# EAGLE design Jeju_v1 v1 (EAGLE 9.7.0)
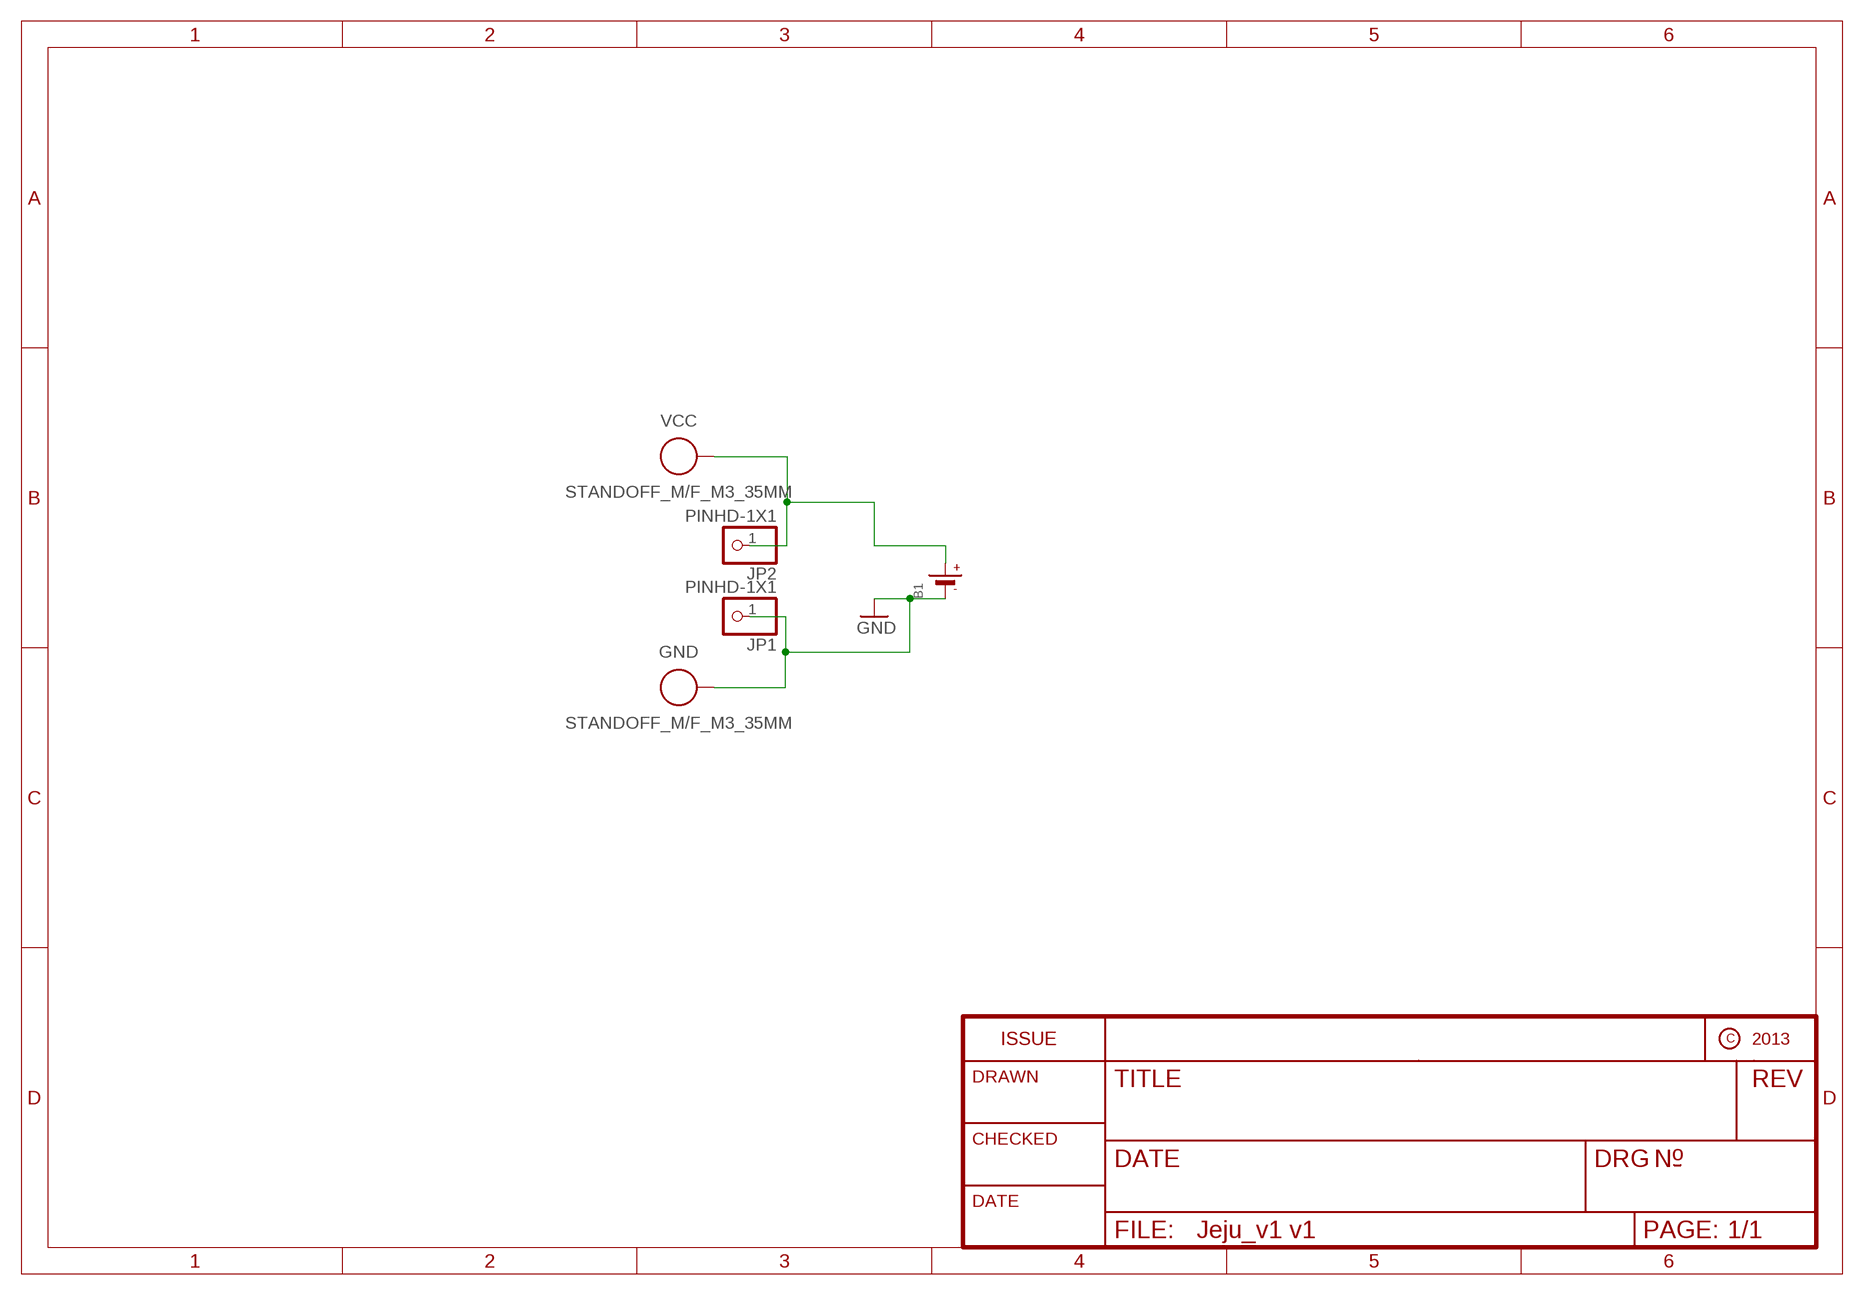
[diagram p0: schematic, sheet 1]

## Parts
B1  BATTERYCR2032_BAT-HLD-001  [CR2032_SMT_BAT-HLD-001]
GND  STANDOFF_M/F_M3_35MM  [STANDOFF_HEX_MALE-FEMALE_500X3500_M3X0.5_MTGP800H320]
JP1  PINHD-1X1  [1X01]
JP2  PINHD-1X1  [1X01]
VCC  STANDOFF_M/F_M3_35MM  [STANDOFF_HEX_MALE-FEMALE_500X3500_M3X0.5_MTGP800H320]

## Nets
3V: B1.+$1(+) B1.+$2(+) JP2.1 VCC.1
GND: B1.- GND.1 JP1.1

## Library data of the parts
B1 = microbuilder:BATTERY: CR1220 SMT - Digikey: 3001K-ND CD2032 BAT-HLD-001 - Digikey: BAT-HLD-001-ND
GND VCC = PCB-Fasteners_Hardware:STANDOFF_M/F: Male-Male Standoff/Spacer with Mounting pad and hole. Essentra : Male-Female Standoff <https://www.essentracomponents.co.in/index.php?option=com_virtuemart&view=productdetails&virtuemart_product_id=14556> The hole and pad sizes may vary based on the application and type of hardware; always verify the Manufacturer specification or Global Standards.; CATEGORY: Standoff/Spacer; SUB-CATEGORY: Male-Female
JP1 JP2 = Connector:PINHD-1X1: PIN HEADER; CATEGORY: Headers; DESCRIPTION: Header, Straight, 1 Position; MANUFACTURER: Generic; MPN: Generic; OPERATING_TEMPERATURE: Generic; PART_STATUS: Active; PITCH: 0.100" (2.54mm); ROHS_COMPLIANCE: Generic; SERIES: Generic; SUB-CATEGORY: Headers, Male Pins; TYPE: Board to Board or Cable, Unshrouded, Through Hole, Straight

## Board
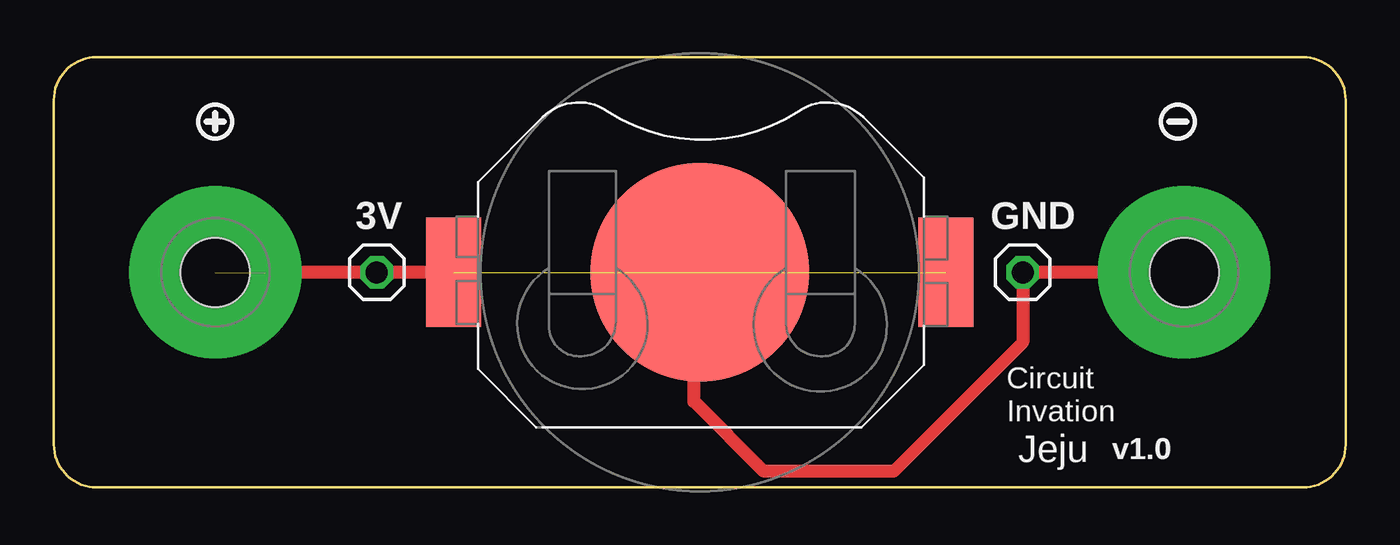
[diagram p1: board, top side]
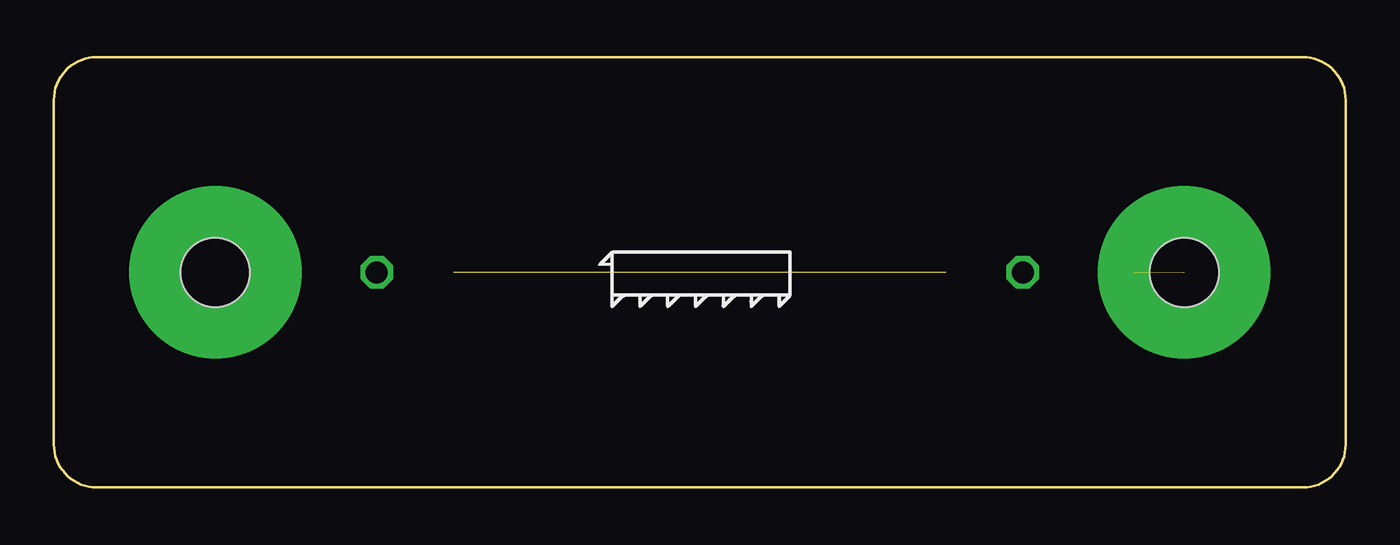
[diagram p2: board, bottom side, seen from below]

Size 60 x 20 mm. Coordinates in mm from the lower left corner, seen from the top.
Outline: 60,18 60,2 arc-90 58,0 2,0 arc-90 0,2 0,18 arc-90 2,20 58,20 arc-90 60,18
Copper layers (1*16): Top / Bottom
Stack-up Default Layer Stack: Top User Defined 0.035mm / Dielectric-1 User Defined 1.5mm / Bottom User Defined 0.035mm
Design rules "default": minimum track width 10mil, minimum drill 16mil, track to track 8mil, track to pad 8mil, pad to pad 8mil, via to via 8mil, smd to smd 8mil, copper to edge 10mil, drill to drill 8mil, minimum pad ring 10mil, minimum via ring 8mil, stop-mask expansion 4mil, vias tented up to drill 20mil, thermal gap 10mil

### Footprints (pad centres in the part's own frame; a part is rotated, then mirrored left to right if it is on the bottom)
CR2032_SMT_BAT-HLD-001 = smd 2.54 x 5.08: +$1 -11.43,0; +$2 11.43,0 | smd 10.16 x 10.16: - 0,0
STANDOFF_HEX_MALE-FEMALE_500X3500_M3X0.5_MTGP800H320 = drill 3.2 pad 8: 1 0,0 | hole 3.2: 0,0
1X01 = drill 1.016 octagon: 1 0,0

### Placement (x,y rotation side)
B1  30,10 180 top
GND  52.5,10 0 top
JP1  45,10 0 top
JP2  15,10 0 top
U$6  [SYMBOL_PLUS]  7.5,17 0 top
U$7  [SYMBOL_MINUS]  52.2,17 0 top
VCC  7.5,10 0 top

### Tracks (layer width: path | path; a pad name or v marks a point on that pad's centre or on a via)
3V  (2 unrouted)
  Top 0.61: 9.82,9.98 9.85,10 JP2.1 B1.+$2
GND
  Top 0.61: GND.1 JP1.1 45,6.75 39.01,0.76 32.96,0.76 29.73,4 29.73,9.73 B1.-

### Text on the board
tPlace: 3V | GND | Circuit / Invation | Jeju | v1.0